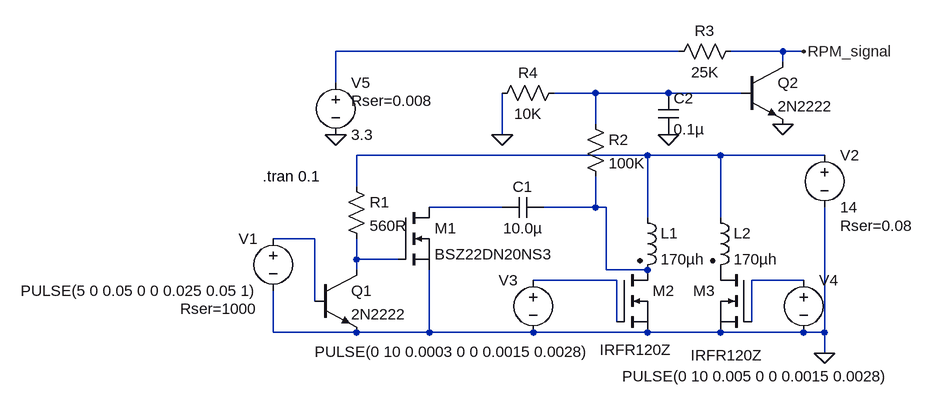
[diagram p0: schematic shifter.asc]
shifter.asc, the LTspice schematic file:
Version 4
SHEET 1 1080 680
WIRE 416 -128 -112 -128
WIRE 576 -128 496 -128
WIRE 608 -128 576 -128
WIRE 576 -112 576 -128
WIRE -112 -80 -112 -128
WIRE 288 -64 224 -64
WIRE 400 -64 288 -64
WIRE 512 -64 400 -64
WIRE 288 -16 288 -64
WIRE 144 0 144 -64
WIRE 368 32 -80 32
WIRE 480 32 368 32
WIRE 640 32 480 32
WIRE -80 80 -80 32
WIRE 144 112 32 112
WIRE 288 112 288 64
WIRE 288 112 208 112
WIRE 304 112 288 112
WIRE 368 128 368 32
WIRE 480 128 480 32
WIRE -144 160 -208 160
WIRE -80 192 -80 160
WIRE -16 192 -80 192
WIRE -80 208 -80 192
WIRE 304 208 304 112
WIRE 368 208 304 208
WIRE 320 224 192 224
WIRE 608 224 528 224
WIRE -144 256 -144 160
WIRE 320 288 320 224
WIRE 528 288 528 224
WIRE -208 304 -208 240
WIRE -80 304 -208 304
WIRE 32 304 32 208
WIRE 32 304 -80 304
WIRE 192 304 32 304
WIRE 368 304 192 304
WIRE 480 304 368 304
WIRE 608 304 480 304
WIRE 640 304 640 112
WIRE 640 304 608 304
WIRE 640 336 640 304
FLAG 640 336 0
FLAG 576 -16 0
FLAG -112 0 0
FLAG 400 0 0
FLAG 144 0 0
FLAG 608 -128 RPM_signal
SYMBOL voltage -208 144 M0
WINDOW 123 0 0 Left 2
WINDOW 39 24 124 Left 2
SYMATTR SpiceLine Rser=1000
SYMATTR InstName V1
SYMATTR Value PULSE(5 0 0.05 0 0 0.025 0.05 1)
SYMBOL voltage 640 16 R0
WINDOW 123 0 0 Left 2
WINDOW 39 24 124 Left 2
SYMATTR SpiceLine Rser=0.08
SYMATTR InstName V2
SYMATTR Value 14
SYMBOL ind2 352 112 R0
SYMATTR InstName L1
SYMATTR Value 170µh
SYMATTR Type ind
SYMATTR SpiceLine Rser=2.5 Rpar=33000 Cpar=4.6p
SYMBOL nmos 320 208 R0
WINDOW 3 -26 123 Left 2
SYMATTR Value IRFR120Z
SYMATTR InstName M2
SYMBOL voltage 192 208 M0
WINDOW 123 0 0 Left 2
WINDOW 39 0 0 Left 2
WINDOW 3 -89 126 Left 2
SYMATTR Value PULSE(0 10 0.0003 0 0 0.0015 0.0028)
SYMATTR InstName V3
SYMBOL nmos -16 112 R0
SYMATTR InstName M1
SYMATTR Value BSZ22DN20NS3
SYMBOL cap 208 96 R90
WINDOW 0 0 32 VBottom 2
WINDOW 3 32 32 VTop 2
SYMATTR InstName C1
SYMATTR Value 10.0µ
SYMATTR SpiceLine V=100 Rser=0.25 Lser=0
SYMBOL npn -144 208 R0
SYMATTR InstName Q1
SYMATTR Value 2N2222
SYMBOL res -96 64 R0
SYMATTR InstName R1
SYMATTR Value 560R
SYMBOL ind2 464 112 R0
SYMATTR InstName L2
SYMATTR Value 170µh
SYMATTR Type ind
SYMATTR SpiceLine Rser=2.5 Rpar=33000 Cpar=4.6p
SYMBOL nmos 528 208 M0
WINDOW 3 -18 131 Left 2
SYMATTR Value IRFR120Z
SYMATTR InstName M3
SYMBOL voltage 608 208 R0
WINDOW 3 -279 164 Left 2
WINDOW 123 0 0 Left 2
WINDOW 39 0 0 Left 2
SYMATTR Value PULSE(0 10 0.005 0 0 0.0015 0.0028)
SYMATTR InstName V4
SYMBOL res 272 -32 R0
SYMATTR InstName R2
SYMATTR Value 100K
SYMBOL npn 512 -112 R0
SYMATTR InstName Q2
SYMATTR Value 2N2222
SYMBOL voltage -112 -96 R0
WINDOW 123 0 0 Left 2
WINDOW 39 24 44 Left 2
SYMATTR SpiceLine Rser=0.008
SYMATTR InstName V5
SYMATTR Value 3.3
SYMBOL res 512 -144 R90
WINDOW 0 0 56 VBottom 2
WINDOW 3 32 56 VTop 2
SYMATTR InstName R3
SYMATTR Value 25K
SYMBOL cap 384 -64 R0
SYMATTR InstName C2
SYMATTR Value 0.1µ
SYMATTR SpiceLine V=16 Irms=0 Rser=0.007 Lser=0
SYMBOL res 240 -80 R90
WINDOW 0 0 56 VBottom 2
WINDOW 3 32 56 VTop 2
SYMATTR InstName R4
SYMATTR Value 10K
TEXT -224 64 Left 2 !.tran 0.1

The netlist it stands for:
* shifter.asc
V1 N006 0 PULSE(5 0 0.05 0 0 0.025 0.05 1) Rser=1000
V2 N003 0 14 Rser=0.08
L1 N003 N005 170µh Rser=2.5 Rpar=33000 Cpar=4.6p
M2 N005 N008 0 0 IRFR120Z
V3 N008 0 PULSE(0 10 0.0003 0 0 0.0015 0.0028)
M1 N004 N007 0 0 BSZ22DN20NS3
C1 N005 N004 10.0µ V=100 Rser=0.25 Lser=0
Q1 N007 N006 0 0 2N2222
R1 N003 N007 560R
L2 N003 P001 170µh Rser=2.5 Rpar=33000 Cpar=4.6p
M3 P001 N009 0 0 IRFR120Z
V4 N009 0 PULSE(0 10 0.005 0 0 0.0015 0.0028)
R2 N002 N005 100K
Q2 RPM_signal N002 0 0 2N2222
V5 N001 0 3.3 Rser=0.008
R3 RPM_signal N001 25K
C2 N002 0 0.1µ V=16 Irms=0 Rser=0.007 Lser=0
R4 N002 0 10K
.model NPN NPN
.model PNP PNP
.lib standard.bjt
.model NMOS NMOS
.model PMOS PMOS
.lib standard.mos
.tran 0.1
.backanno
.end